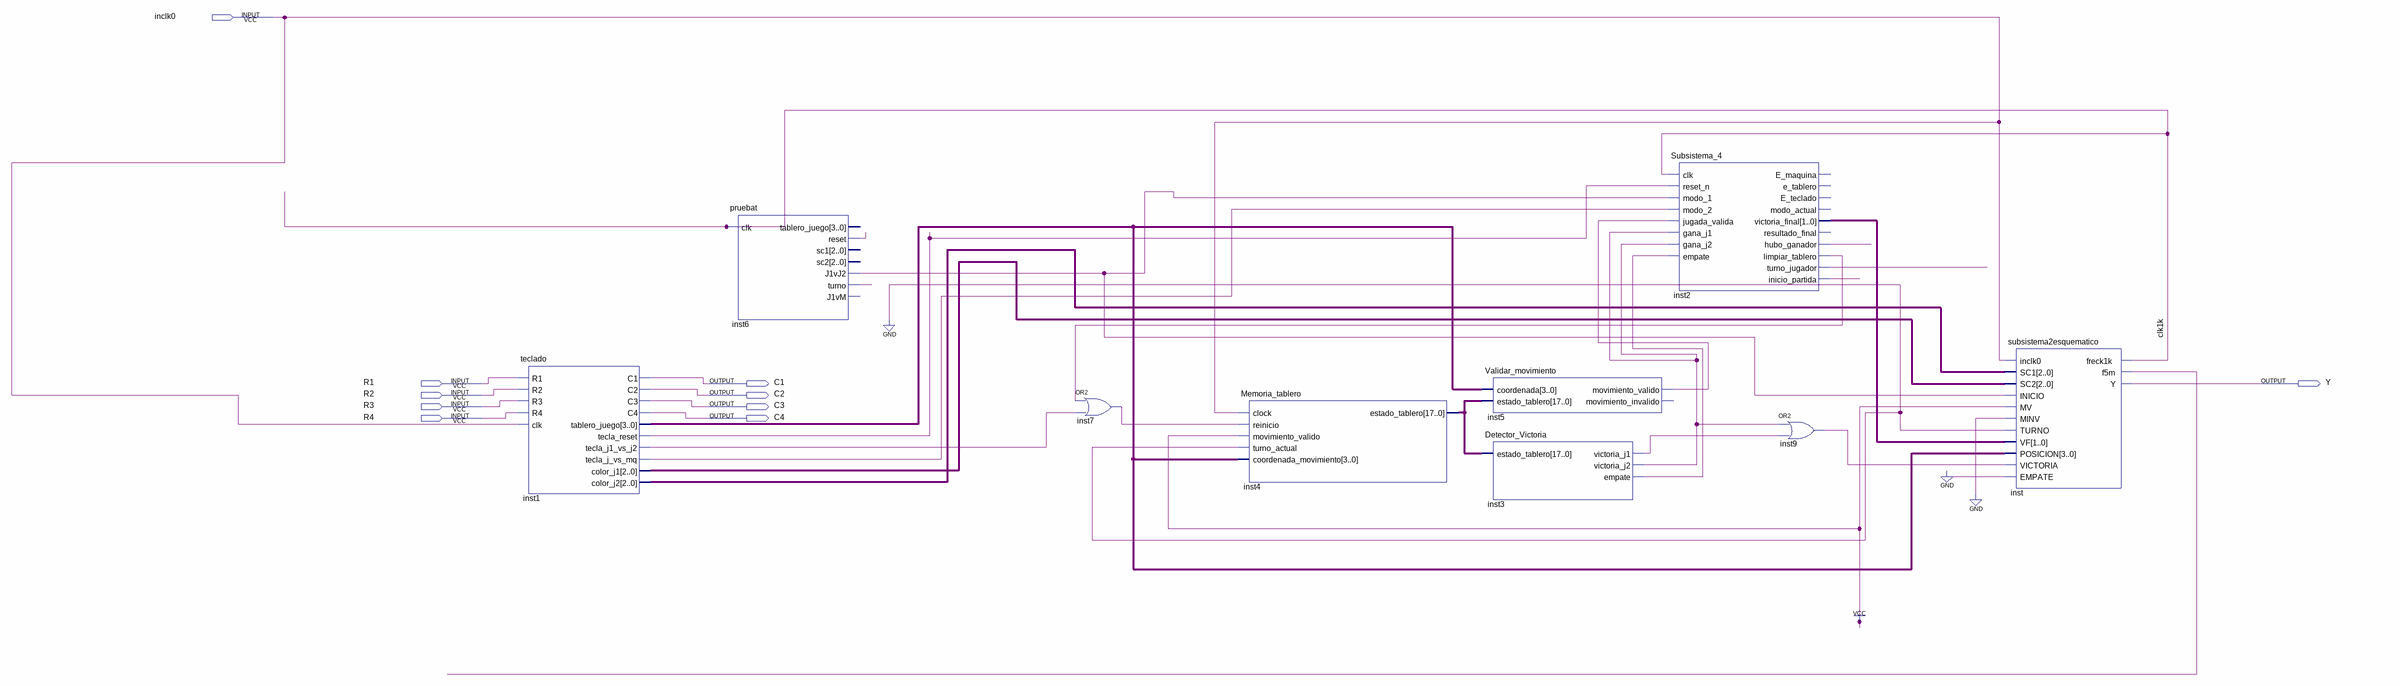
[diagram p0: schematic sheet]
// Quartus schematic proyecto_final.bdf as structural Verilog: 9 symbols, 10 pins
module proyecto_final (
  input  inclk0,
  input  R1,
  input  R2,
  input  R3,
  input  R4,
  output C1,
  output Y,
  output C2,
  output C3,
  output C4
);

  wire clk1k, inst1_tecla_j1_vs_j2, inst1_tecla_j_vs_mq, inst1_tecla_reset, inst2_hubo_ganador,
       inst2_inicio_partida, inst2_limpiar_tablero, inst2_turno_jugador, inst3_empate, inst3_victoria_j1,
       inst3_victoria_j2, inst5_movimiento_valido, inst6_j1vj2, inst6_reset, inst6_turno, inst7_out,
       inst9_out, inst_f5m;
  wire [1:0] inst2_victoria_final;
  wire [2:0] inst1_color_j1, inst1_color_j2;
  wire [3:0] inst1_tablero_juego;
  wire [17:0] inst4_estado_tablero;

  teclado inst1 (
    .R1(R1), .R2(R2), .R3(R3), .R4(R4), .clk(inclk0), .C1(C1), .C2(C2), .C3(C3), .C4(C4),
    .tablero_juego(inst1_tablero_juego), .tecla_reset(inst1_tecla_reset),
    .tecla_j1_vs_j2(inst1_tecla_j1_vs_j2), .tecla_j_vs_mq(inst1_tecla_j_vs_mq), .color_j1(inst1_color_j1),
    .color_j2(inst1_color_j2));
  pruebat inst6 (
    .clk(clk1k), .reset(inst6_reset), .J1vJ2(inst6_j1vj2), .turno(inst6_turno));  // open: tablero_juego, sc1, sc2, J1vM
  or inst7 (inst7_out, inst2_limpiar_tablero, inst1_tecla_j1_vs_j2);
  Memoria_tablero inst4 (
    .clock(inclk0), .reinicio(inst7_out), .movimiento_valido(1'b1), .turno_actual(1'b0),
    .coordenada_movimiento(inst1_tablero_juego), .estado_tablero(inst4_estado_tablero));
  Validar_movimiento inst5 (
    .coordenada(inst1_tablero_juego), .estado_tablero(inst4_estado_tablero),
    .movimiento_valido(inst5_movimiento_valido));  // open: movimiento_invalido
  Detector_Victoria inst3 (
    .estado_tablero(inst4_estado_tablero), .victoria_j1(inst3_victoria_j1), .victoria_j2(inst3_victoria_j2),
    .empate(inst3_empate));
  Subsistema_4 inst2 (
    .clk(clk1k), .reset_n(inst1_tecla_reset), .modo_1(inst6_j1vj2), .modo_2(inst1_tecla_j_vs_mq),
    .jugada_valida(inst5_movimiento_valido), .gana_j1(inst3_victoria_j2), .gana_j2(inst3_victoria_j2),
    .empate(inst3_empate), .victoria_final(inst2_victoria_final), .hubo_ganador(inst2_hubo_ganador),
    .limpiar_tablero(inst2_limpiar_tablero), .turno_jugador(inst2_turno_jugador),
    .inicio_partida(inst2_inicio_partida));  // open: E_maquina, e_tablero, E_teclado, modo_actual, resultado_final
  or inst9 (inst9_out, inst3_victoria_j2, inst3_victoria_j1);
  subsistema2esquematico inst (
    .inclk0(inclk0), .SC1(inst1_color_j2), .SC2(inst1_color_j1), .INICIO(inst6_j1vj2), .MV(1'b1),
    .MINV(1'b0), .TURNO(1'b0), .VF(inst2_victoria_final), .POSICION(inst1_tablero_juego),
    .VICTORIA(inst9_out), .EMPATE(1'b0), .freck1k(clk1k), .f5m(inst_f5m), .Y(Y));
endmodule
